# EAGLE design SparkFun_Qwiic_Encryption_ATECC508A (EAGLE 9.4.2)
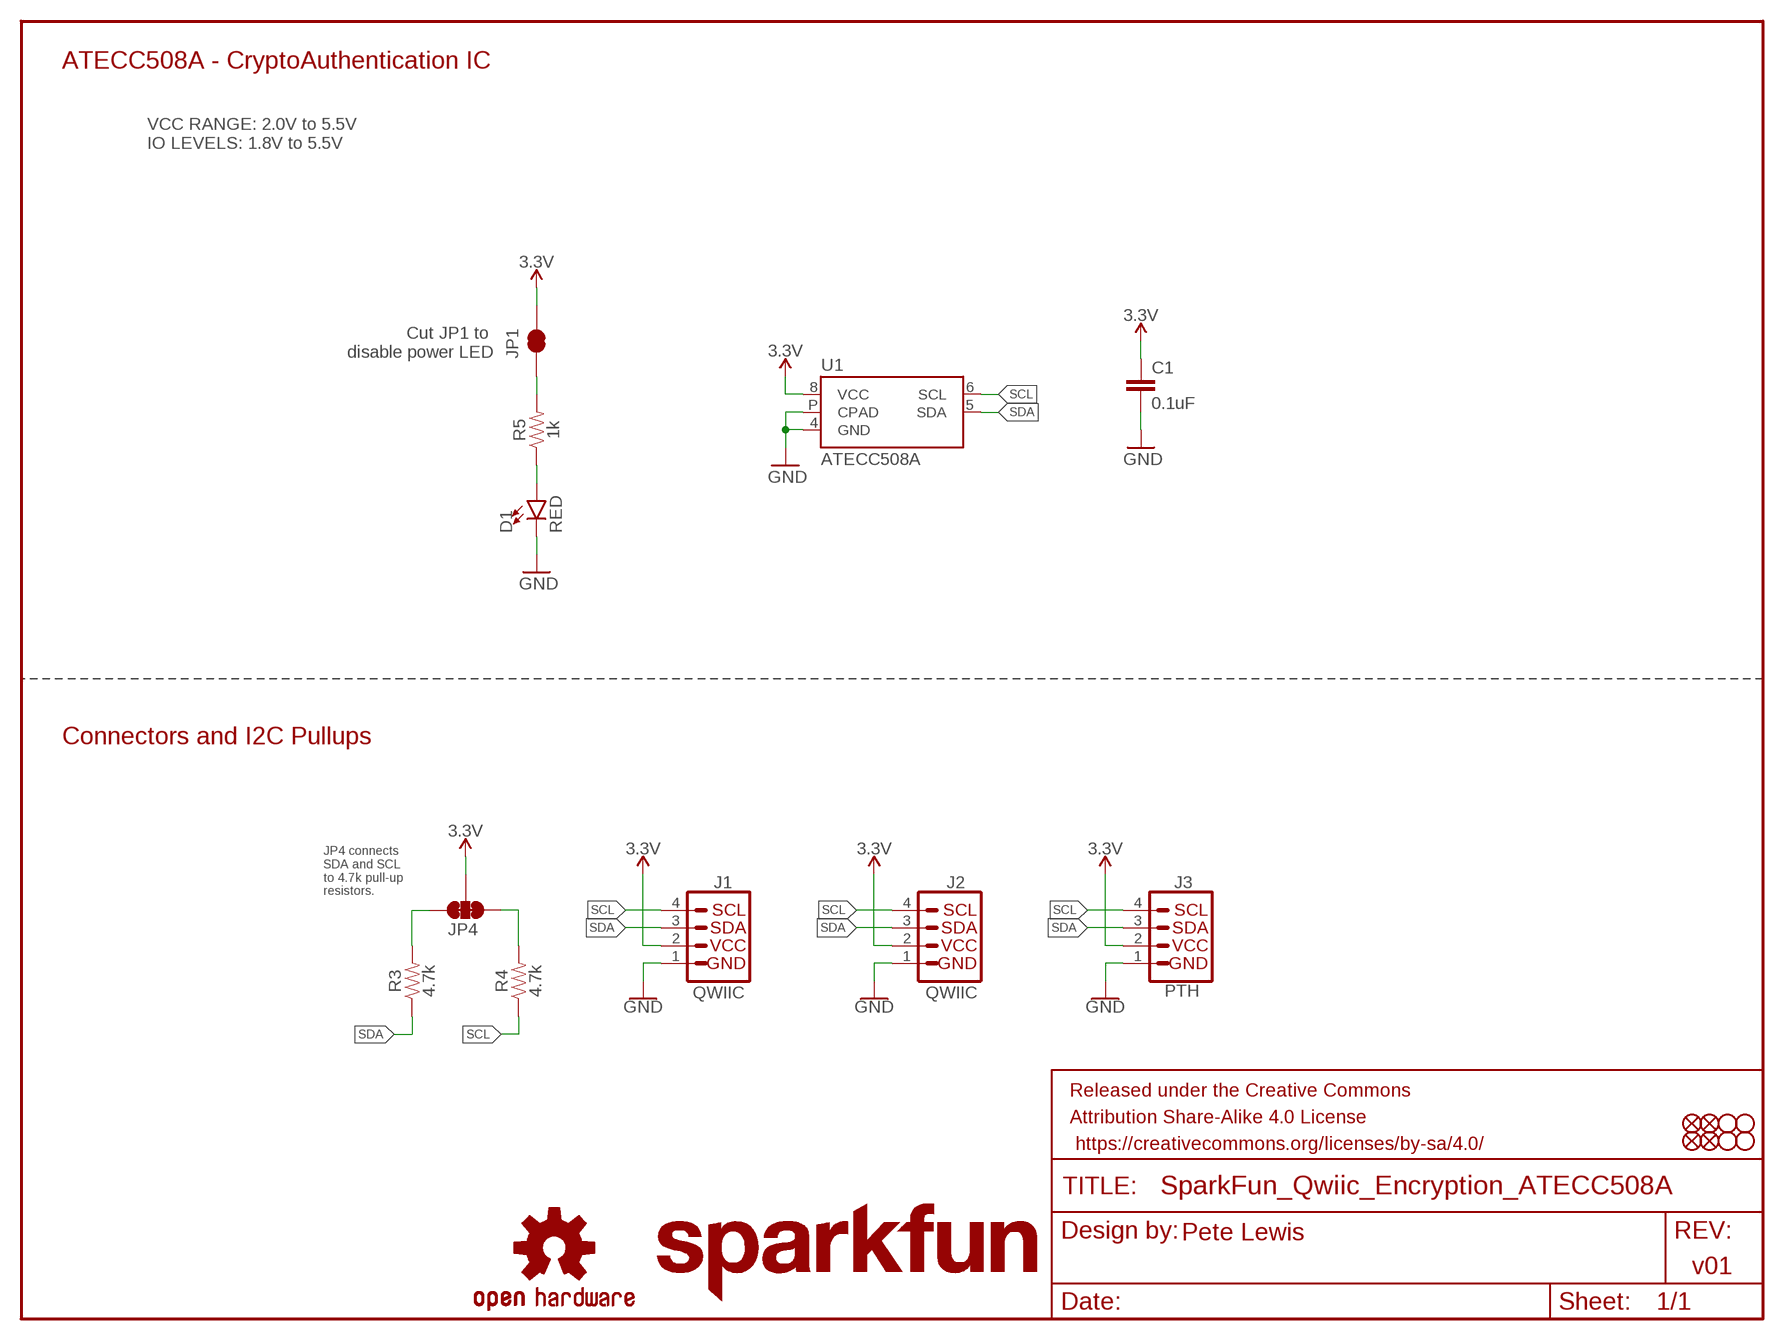
[diagram p0: schematic, sheet 1]

## Parts
C1  0.1uF  0.1UF-0603-25V-(+80/-20%)  [0603]
D1  RED  LED-RED0603  [LED-0603]
FD1  FIDUCIAL1X2  [FIDUCIAL-1X2]
FD2  FIDUCIAL1X2  [FIDUCIAL-1X2]
FD3  FIDUCIAL1X2  [FIDUCIAL-1X2]
FD4  FIDUCIAL1X2  [FIDUCIAL-1X2]
FRAME1  FRAME-LETTER  [CREATIVE_COMMONS]
H1  STAND-OFF  [STAND-OFF]
H2  STAND-OFF  [STAND-OFF]
H3  STAND-OFF  [STAND-OFF]
H4  STAND-OFF  [STAND-OFF]
J1  QWIIC  I2C_STANDARDQWIIC  [JST04_1MM_RA]
J2  QWIIC  I2C_STANDARDQWIIC  [JST04_1MM_RA]
J3  PTH  I2C_STANDARD_NO_SILK  [1X04_NO_SILK]
JP1  JUMPER-SMT_2_NC_TRACE_NO-SILK  [SMT-JUMPER_2_NC_TRACE_NO-SILK]
JP4  JUMPER-SMT_3_2-NC_TRACE_NO-SILK  [SMT-JUMPER_3_2-NC_TRACE_NO-SILK]
LOGO1  SFE_LOGO_NAME.1_INCH  [SFE_LOGO_NAME_.1]
LOGO4  OSHW-LOGOS  [OSHW-LOGO-S]
R3  4.7k  4.7KOHM-0603-1/10W-1%  [0603]
R4  4.7k  4.7KOHM-0603-1/10W-1%  [0603]
R5  1k  1KOHM-0603-1/10W-1%  [0603]
U1  ATECC508A  ATECC508AUDFN_2X3MM  [UDFN_2X3MM]

## Nets
3.3V: C1.1 J1.2 J2.2 J3.2 JP1.2 JP4.2 U1.8(VCC)
GND: C1.2 D1.C J1.1 J2.1 J3.1 U1.4(GND) U1.P(CPAD)
N$3: D1.A R5.1
N$4: JP4.3 R3.2
N$5: JP4.1 R4.2
N$7: JP1.1 R5.2
SCL: J1.4 J2.4 J3.4 R4.1 U1.6(SCL)
SDA: J1.3 J2.3 J3.3 R3.1 U1.5(SDA)

## Notes on the sheet
- ATECC508A - CryptoAuthentication IC
- VCC RANGE: 2.0V to 5.5V
  IO LEVELS: 1.8V to 5.5V
- Cut JP1 to 
  disable power LED
- Connectors and I2C Pullups
- JP4 connects 
  SDA and SCL 
  to 4.7k pull-up 
  resistors.
- Pete Lewis
- v01

## Library data of the parts
C1 = SparkFun-Capacitors:0.1UF: 0.1µF ceramic capacitors A capacitor is a passive two-terminal electrical component used to store electrical energy temporarily in an electric field.; PROD_ID: CAP-00810
D1 = SparkFun-LED:LED-RED: Red SMD LED Used in manufacturing of most products at SparkFun Packages: 0603 - SMD 0603 package [Product Link] <http://docs.avagotech.com/docs/AV02-0551EN> 0603 SMART - SMD 0603 SMART package ( more efficient and expensive)[Product Link] <http://www.osram-os.com/Graphics/XPic2/00077099_0.pdf> 1206 - SMD1206 package [Product Link] <https://www.sparkfun.com/datasheets/DevTools/LilyPad/Q150OVS4.pdff> SparkFun Products: Pro Mini 328 -5V <https://www.sparkfun.com/products/821> RedBoard <https://www.sparkfun.com/products/12757> IOIO-OTG <https://www.sparkfun.com/products/13613>; PROD_ID: DIO-00819
FD1-FD4 = SparkFun-Aesthetics:FIDUCIAL: Fiducial Alignment Points Point-of-reference for pick-and-place machines and other optical instruments.
FRAME1 = SparkFun-Aesthetics:FRAME-LETTER: Schematic Frame - Letter Standard 8.5x11 US Letter frame
H1-H4 = SparkFun-Hardware:STAND-OFF: Stand Off Drill holes for mechanically mounting via screws, standoffs, etc. Note: Use the keepout ring to avoid running the screw head into surrounding components. Variant Overviews STAND-OFF - Mechanical footprint for a #4 phillips button head screw. STAND-OFF-TIGHT - Mechanical footprint for a #4 phillips button head screw, Example SparkFun Products Screw - Phillips Head (1/4", 4-40, 10 pack) <https://www.sparkfun.com/products/10453> (PRT-10453) Screw - Phillips Head (1/2", 4-40, 10 pack) <https://www.sparkfun.com/products/10452> (PRT-10452) Screw - Phillips Head (3/4", 4-40, 10 pack) <https://www.sparkfun.com/products/10451> (PRT-10451) Screw - Phillips Head (1", 4-40, 10 pack) <https://www.sparkfun.com/products/10450> (PRT-10450)
J1 J2 = SparkFun-Connectors:I2C_STANDARD: SparkFun I2C Standard Pinout Header SparkFun has standardized on a pinout for all I2C based sensor breakouts. This pinout allows I2C boards to be plugged directly into the headers on Arduino Uno compatible boards, and to be daisy chained easily. Example SparkFun Products: SparkFun Atmospheric Sensor Breakout - BME280 <https://www.sparkfun.com/products/13676> SparkFun Altitude/Pressure Sensor Breakout - MPL3115A2 <https://www.sparkfun.com/products/11084> SparkFun TOF Range Finder Sensor - VL6180 <https://www.sparkfun.com/products/12785>; PROD_ID: CONN-13694; VALUE: Qwiic Right Angle
J3 = SparkFun-Connectors:I2C_STANDARD: SparkFun I2C Standard Pinout Header SparkFun has standardized on a pinout for all I2C based sensor breakouts. This pinout allows I2C boards to be plugged directly into the headers on Arduino Uno compatible boards, and to be daisy chained easily. Example SparkFun Products: SparkFun Atmospheric Sensor Breakout - BME280 <https://www.sparkfun.com/products/13676> SparkFun Altitude/Pressure Sensor Breakout - MPL3115A2 <https://www.sparkfun.com/products/11084> SparkFun TOF Range Finder Sensor - VL6180 <https://www.sparkfun.com/products/12785>
JP1 = SparkFun-Jumpers:JUMPER-SMT_2_NC_TRACE: Normally closed trace jumper This jumper has a trace between two pads so it's normally closed (NC). Use a razor knife to open the connection. For best results follow the IPC guidelines for cutting traces: Cutout at least 0.063 mm (0.005 in). Remove all loose material to clean up the cut area. Seal the cut with an approved epoxy. Reapply solder to reclose the connection.
JP4 = SparkFun-Jumpers:JUMPER-SMT_3_2-NC_TRACE: Normally closed trace jumper (2 of 2 connections) This jumper has a trace between all three pads so they are normally closed (NC). Use a razor knife to open the connection(s). For best results follow the IPC guidelines for cutting traces: Cutout at least 0.063 mm (0.005 in). Remove all loose material to clean up the cut area. Seal the cut with an approved epoxy. Reapply solder to reclose the connection(s).
LOGO1 = SparkFun-Aesthetics:SFE_LOGO_NAME: SparkFun Font Logo This is the SparkFun name logo. The logo on the schematic will always be the same size; the package variant is the height of the flame part of the logo (or the height the flame would be, if it were drawn). Default layer for the logo on the board is tSilk.
LOGO4 = SparkFun-Aesthetics:OSHW-LOGO: Open-Source Hardware (OSHW) Logo This logo indicates the piece of hardware it is found on incorporates a OSHW license and/or adheres to the definition of open source hardware found here: http://freedomdefined.org/OSHW
R3 R4 = SparkFun-Resistors:4.7KOHM: 4.7kΩ resistor A resistor is a passive two-terminal electrical component that implements electrical resistance as a circuit element. Resistors act to reduce current flow, and, at the same time, act to lower voltage levels within circuits. - Wikipedia; PROD_ID: RES-07857
R5 = SparkFun-Resistors:1KOHM: 1kΩ resistor A resistor is a passive two-terminal electrical component that implements electrical resistance as a circuit element. Resistors act to reduce current flow, and, at the same time, act to lower voltage levels within circuits. - Wikipedia; PROD_ID: RES-07856
U1 = ATECC508A:ATECC508A: ATECC508A CryptoAuthentication Device Cryptographic Co-processor with Secure Hardware-Based Key Storage ECDSA: FIPS186-3 Elliptic Curve Digital Signature Algorithm ECDH: FIPS SP800-56A Elliptic Curve Diffie-Hellman Algorithm NIST Standard P256 Elliptic Curve Support SHA-256 Hash Algorithm with HMAC Option 1 MHz Standard I2C Interface 2.0V to 5.5V Supply Voltage Range 1.8V to 5.5V IO levels Datasheet <http://ww1.microchip.com/downloads/en/DeviceDoc/20005927A.pdf> SparkFun Products Qwiic IoT Security ATECC508A <https://www.sparkfun.com/products/XXXXX> (DEV-XXXXX)

## Board
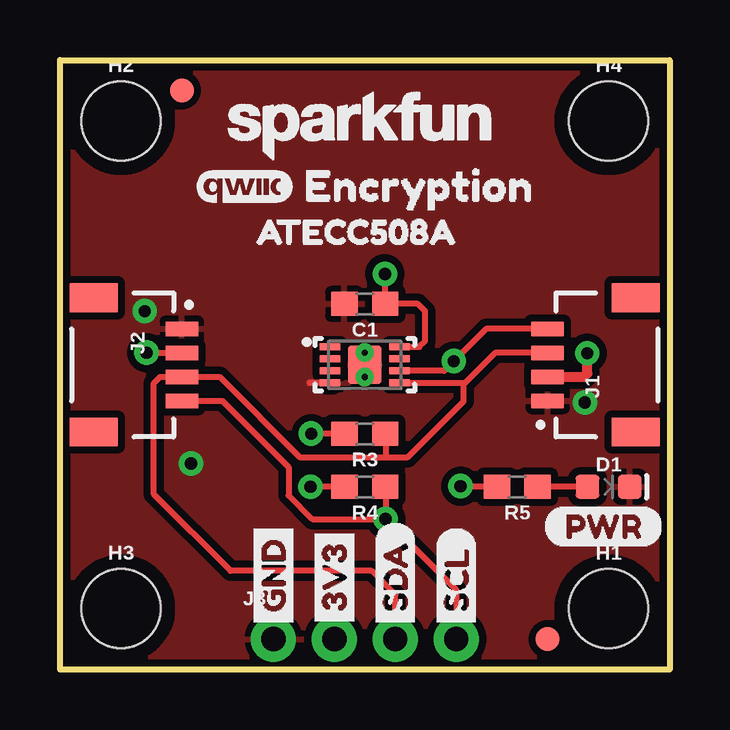
[diagram p1: board, top side]
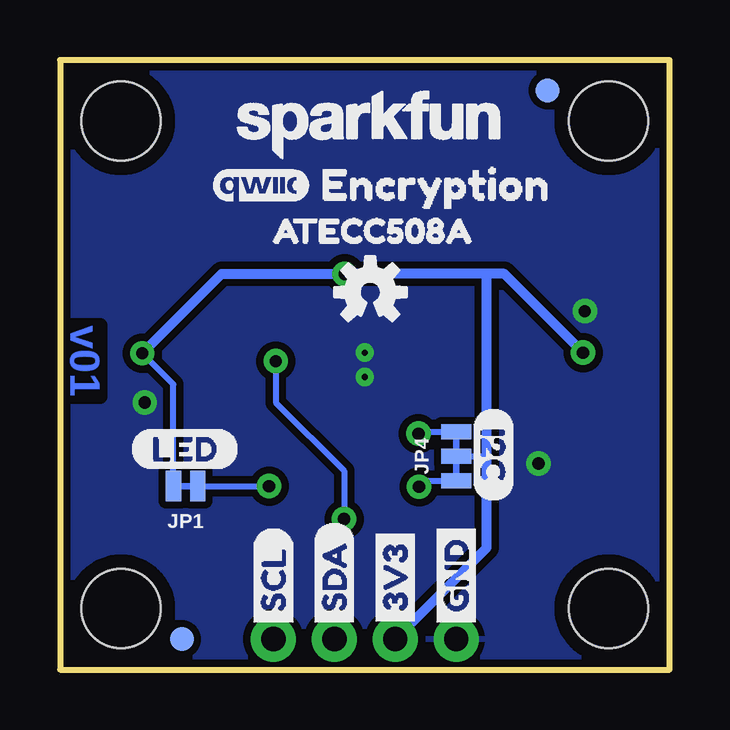
[diagram p2: board, bottom side, seen from below]

Size 25.4 x 25.4 mm. Coordinates in mm from the lower left corner, seen from the top.
Outline: 0,0 0,25.4 25.4,25.4 25.4,0 0,0
Copper layers (1*16): Top 0.035mm / dielectric 1.5mm / Bottom 0.035mm
Design rules "SparkFun-2-layer-STANDARD": minimum track width 10mil, minimum drill 20mil, track to track 10mil, track to pad 8mil, pad to pad 8mil, via to via 10mil, smd to smd 8mil, copper to edge 8mil, drill to drill 8mil, minimum pad ring 10mil, minimum via ring 10mil, stop-mask expansion 4mil, vias tented up to drill 25mil, thermal gap 10mil
tRestrict: area 11,11.8 to 11.4,11.8

### Footprints (pad centres in the part's own frame; a part is rotated, then mirrored left to right if it is on the bottom)
0603 = smd 1.1 x 1: 1 -0.85,0; 2 0.85,0
LED-0603 = smd 1 x 1: A -0.877,0; C 0.877,0
FIDUCIAL-1X2 = smd 1 x 1: 1 0,0
STAND-OFF = hole 3.302: 0,0
JST04_1MM_RA = smd 0.6 x 1.35: 1 -1.5,0; 2 -0.5,0; 3 0.5,0; 4 1.5,0 | smd 1.2 x 2: NC1 2.8,-3.675; NC2 -2.8,-3.675
1X04_NO_SILK = drill 1.016 pad 1.88: 1 0,0; 2 2.54,0; 3 5.08,0; 4 7.62,0
SMT-JUMPER_2_NC_TRACE_NO-SILK = smd 0.635 x 1.27: 1 -0.508,0; 2 0.508,0
SMT-JUMPER_3_2-NC_TRACE_NO-SILK = smd 0.635 x 1.27: 1 -1.016,0; 2 0,0; 3 1.016,0
UDFN_2X3MM = smd 0.3 x 0.85: 1 -0.75,-1.45; 2 -0.25,-1.45; 3 0.25,-1.45; 4 0.75,-1.45; 5 0.75,1.45; 6 0.25,1.45; 7 -0.25,1.45; 8 -0.75,1.45 | smd 1.6 x 1.4: P 0,0

### Placement (x,y rotation side)
C1  12.7,15.24 180 top
D1  22.86,7.62 0 top
FD1  5.08,24.13 0 top
FD2  20.32,1.27 0 top
FD3  20.32,1.27 0 bottom
FD4  5.08,24.13 0 bottom
FRAME1  -13.97,-12.7 0 top  (outside the outline)
H1  22.86,2.54 0 top
H2  2.54,22.86 0 top
H3  2.54,2.54 0 top
H4  22.86,22.86 0 top
J1  20.32,12.7 90 top
J2  5.08,12.7 270 top
J3  8.89,1.27 0 top
JP1  20.17,7.65 180 bottom
JP4  8.89,8.89 90 bottom
LOGO1  12.5,22.65 0 top
LOGO3  SFE_LOGO_NAME.1_INCH  [SFE_LOGO_NAME_.1@1]  18.49,20.8 0 bottom
LOGO4  12.47,15.72 0 bottom
R3  12.7,9.83 180 top
R4  12.7,7.62 180 top
R5  19.05,7.62 180 top
U1  12.7,12.7 270 top
U$1  [LED0]  22.5,9.19 0 bottom
U$2  [3V34]  11.43,1.5 90 top
U$3  [SDA5]  13.97,1.5 90 bottom
U$4  [GND3]  8.89,1.5 90 top
U$5  [SDA5]  13.97,1.5 90 top
U$6  [SCL6]  16.51,1.5 90 top
U$7  [3V34]  11.43,1.5 90 bottom
U$8  [GND3]  8.89,1.5 90 bottom
U$9  [QWIIC_4MM]  17.02,20.17 0 bottom
U$10  [SCL6]  16.51,1.5 90 bottom
U$11  [ENCRYPTION1]  9.07,20.17 0 top
U$12  [ATECC508A0]  7.26,18.24 0 top
U$13  [PWR0]  20.14,5.97 0 top
U$14  [ATECC508A0]  17.45,18.29 0 bottom
U$15  [ENCRYPTION1]  15.65,20.22 0 bottom
U$16  [QWIIC_4MM]  7.7,20.12 0 top
U$22  [I2C0]  7.34,10.97 270 bottom

### Tracks (layer width: path | path; a pad name or v marks a point on that pad's centre or on a via)
3.3V  (via drill 0.51)
  Top 0.254: v3.61,13.21 v3.62,13.2 J2.2 | U1.8 14.97,13.45 15.21,13.69 15.21,14.94 14.91,15.24 C1.1 v13.55,16.47 v13.54,16.48
  Top 0.406: J1.2 21.83,12.2 21.97,12.34 v21.97,13.18
  Bottom 0.254: JP1.2 20.68,11.89 v21.97,13.18 | JP4.2 7.62,8.89
  Bottom 0.406: 7.62,16.48 6.88,16.48 v3.61,13.21 | 7.62,16.48 v13.54,16.48 18.67,16.48 v21.97,13.18 | J3.2 7.62,5.08 7.62,8.89 7.62,16.48
GND  (via drill 0.25, 0.51)
  Top 0.254: U1.P 12.77,12.63 | U1.P 12.63,12.63 | U1.P 12.77,12.77 | U1.4 10.4,11.95 10.39,11.96
  other vias: 21.87,11.13 3.53,14.94 12.7,13.21 12.7,12.19 5.46,8.59
  pour Top (isolate 0.305): 0,0 25.4,0 25.4,25.4 0,25.4
  pour Bottom (isolate 0.305): 0,25.4 25.4,25.4 25.4,0 0,0
N$3
  Top 0.254: D1.A R5.1
N$4  (via drill 0.51)
  Top 0.254: R3.2 v10.46,9.83
  Bottom 0.254: v10.46,9.83 10.39,9.91 JP4.3
N$5  (via drill 0.51)
  Top 0.254: R4.2 v10.44,7.62
  Bottom 0.254: v10.44,7.62 10.19,7.87 JP4.1
N$7  (via drill 0.51)
  Top 0.254: v16.69,7.64 18.18,7.64 R5.2
  Bottom 0.254: JP1.1 v16.69,7.64
SCL  (via drill 0.51)
  Top 0.254: J1.4 17.76,14.2 v16.41,12.85 16.01,12.45 U1.6 | J2.4 6.76,11.2 9.53,8.43 9.53,7.26 10.52,6.27 v13.56,6.27 | R4.1 13.56,7.61 v13.56,6.27 | v13.56,6.27 16.51,3.33 J3.4
  Bottom 0.254: v13.56,6.27 13.56,8.28 16.41,11.12 v16.41,12.85
SDA
  Top 0.254: J1.3 18.13,13.2 16.88,11.95 | 16.88,11.95 16.87,11.94 16.82,11.94 16.82,11.18 14.49,8.85 13.56,8.85 | J3.3 13.97,3.12 12.98,4.12 7.11,4.12 3.91,7.32 3.91,11.94 4.17,12.2 J2.3 6.65,12.2 9.99,8.85 13.56,8.85 | U1.5 16.88,11.95 | R3.1 13.56,9.82 13.56,8.85

### Text on the board
Bottom: v01
tDocu: Pete Lewis